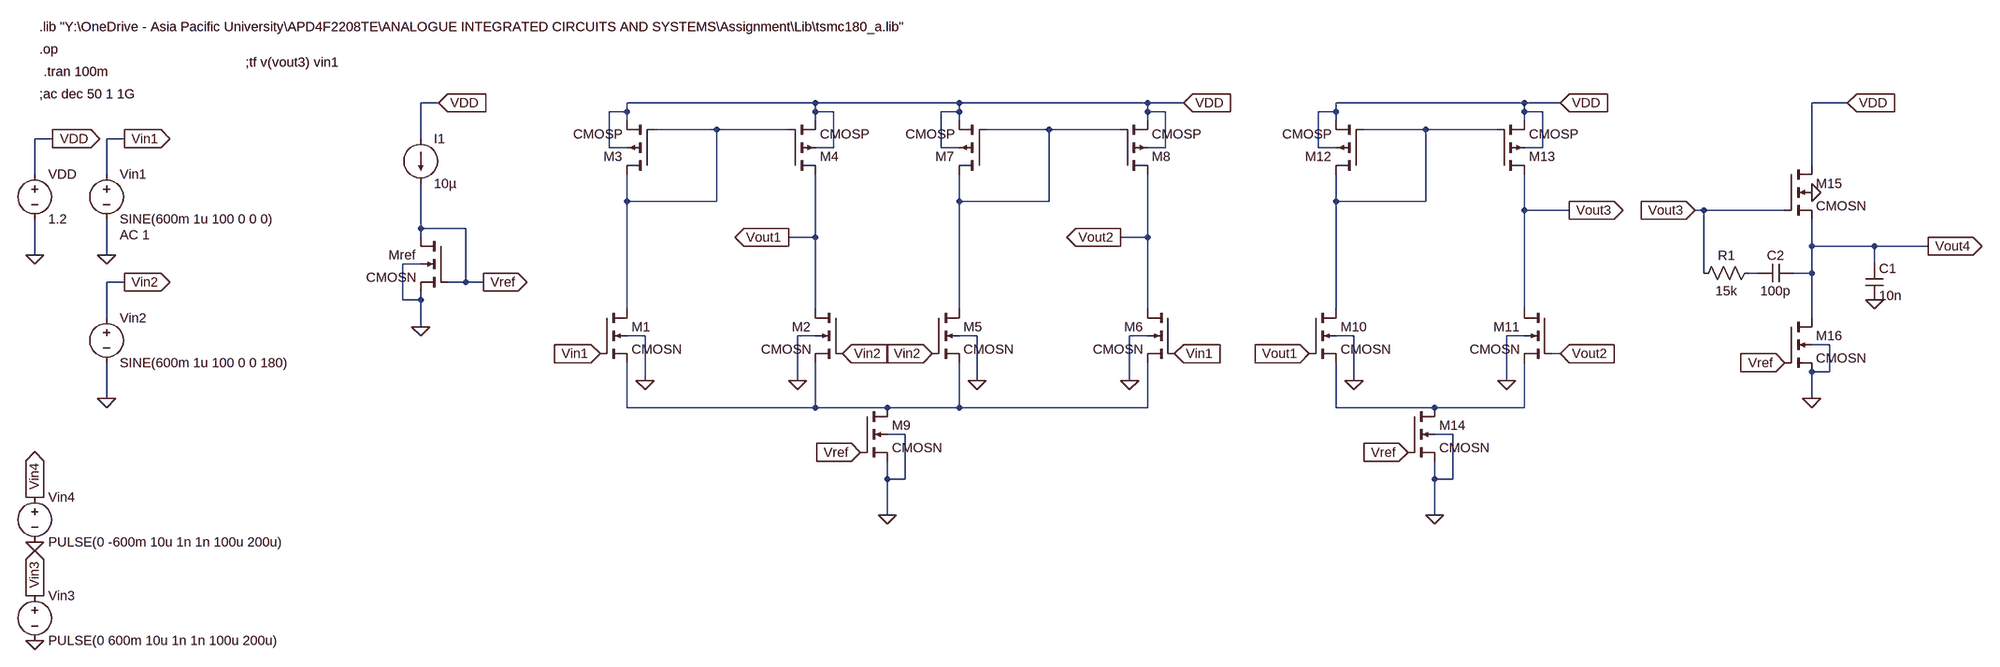
[diagram p0: schematic Final.asc]
Final.asc, the LTspice schematic file:
Version 4
SHEET 1 4092 1284
WIRE -176 -672 -208 -672
WIRE 496 -672 160 -672
WIRE 752 -672 496 -672
WIRE 1088 -672 752 -672
WIRE 1152 -672 1088 -672
WIRE 1760 -672 1424 -672
WIRE 1824 -672 1760 -672
WIRE 2336 -672 2272 -672
WIRE 160 -656 160 -672
WIRE 160 -656 128 -656
WIRE 496 -656 496 -672
WIRE 528 -656 496 -656
WIRE 752 -656 752 -672
WIRE 752 -656 720 -656
WIRE 1088 -656 1088 -672
WIRE 1120 -656 1088 -656
WIRE 1424 -656 1424 -672
WIRE 1424 -656 1392 -656
WIRE 1760 -656 1760 -672
WIRE 1792 -656 1760 -656
WIRE 160 -640 160 -656
WIRE 496 -640 496 -656
WIRE 752 -640 752 -656
WIRE 1088 -640 1088 -656
WIRE 1424 -640 1424 -656
WIRE 1760 -640 1760 -656
WIRE 320 -624 208 -624
WIRE 448 -624 320 -624
WIRE 912 -624 800 -624
WIRE 1040 -624 912 -624
WIRE 1584 -624 1472 -624
WIRE 1712 -624 1584 -624
WIRE -864 -608 -896 -608
WIRE -736 -608 -768 -608
WIRE -208 -608 -208 -672
WIRE 128 -592 128 -656
WIRE 160 -592 128 -592
WIRE 528 -592 528 -656
WIRE 528 -592 496 -592
WIRE 720 -592 720 -656
WIRE 752 -592 720 -592
WIRE 1120 -592 1120 -656
WIRE 1120 -592 1088 -592
WIRE 1392 -592 1392 -656
WIRE 1424 -592 1392 -592
WIRE 1792 -592 1792 -656
WIRE 1792 -592 1760 -592
WIRE 2272 -560 2272 -672
WIRE -896 -544 -896 -608
WIRE -768 -544 -768 -608
WIRE 160 -496 160 -544
WIRE 320 -496 320 -624
WIRE 320 -496 160 -496
WIRE 752 -496 752 -544
WIRE 912 -496 912 -624
WIRE 912 -496 752 -496
WIRE 1424 -496 1424 -544
WIRE 1584 -496 1584 -624
WIRE 1584 -496 1424 -496
WIRE 1760 -480 1760 -544
WIRE 1840 -480 1760 -480
WIRE 2080 -480 2064 -480
WIRE 2224 -480 2080 -480
WIRE -208 -448 -208 -528
WIRE -128 -448 -208 -448
WIRE -208 -432 -208 -448
WIRE 496 -432 496 -544
WIRE 496 -432 448 -432
WIRE 1088 -432 1088 -544
WIRE 1088 -432 1040 -432
WIRE 2272 -416 2272 -464
WIRE 2384 -416 2272 -416
WIRE 2480 -416 2384 -416
WIRE -896 -400 -896 -464
WIRE -768 -400 -768 -464
WIRE -208 -384 -240 -384
WIRE 2384 -384 2384 -416
WIRE 2080 -368 2080 -480
WIRE 2176 -368 2160 -368
WIRE 2272 -368 2272 -416
WIRE 2272 -368 2240 -368
WIRE -736 -352 -768 -352
WIRE -128 -352 -128 -448
WIRE -128 -352 -160 -352
WIRE -96 -352 -128 -352
WIRE -240 -320 -240 -384
WIRE -208 -320 -208 -336
WIRE -208 -320 -240 -320
WIRE 160 -304 160 -496
WIRE 496 -304 496 -432
WIRE 752 -304 752 -496
WIRE 1088 -304 1088 -432
WIRE 1424 -304 1424 -496
WIRE 1760 -304 1760 -480
WIRE -768 -288 -768 -352
WIRE 2272 -288 2272 -368
WIRE -208 -272 -208 -320
WIRE 192 -256 160 -256
WIRE 496 -256 464 -256
WIRE 784 -256 752 -256
WIRE 1088 -256 1056 -256
WIRE 1456 -256 1424 -256
WIRE 1760 -256 1728 -256
WIRE 2304 -240 2272 -240
WIRE 1824 -224 1808 -224
WIRE 2304 -192 2304 -240
WIRE 2304 -192 2272 -192
WIRE 192 -176 192 -256
WIRE 464 -176 464 -256
WIRE 784 -176 784 -256
WIRE 1056 -176 1056 -256
WIRE 1456 -176 1456 -256
WIRE 1728 -176 1728 -256
WIRE -768 -144 -768 -208
WIRE 2272 -144 2272 -192
WIRE 160 -128 160 -208
WIRE 496 -128 496 -208
WIRE 496 -128 160 -128
WIRE 624 -128 496 -128
WIRE 752 -128 752 -208
WIRE 752 -128 624 -128
WIRE 1088 -128 1088 -208
WIRE 1088 -128 752 -128
WIRE 1424 -128 1424 -208
WIRE 1600 -128 1424 -128
WIRE 1760 -128 1760 -208
WIRE 1760 -128 1600 -128
WIRE 656 -80 624 -80
WIRE 1632 -80 1600 -80
WIRE 624 0 624 -32
WIRE 656 0 656 -80
WIRE 656 0 624 0
WIRE 1600 0 1600 -32
WIRE 1632 0 1632 -80
WIRE 1632 0 1600 0
WIRE 624 64 624 0
WIRE 1600 64 1600 0
FLAG 112 -224 Vin1
IOPIN 112 -224 In
FLAG -96 -352 Vref
IOPIN -96 -352 Out
FLAG -208 -272 0
FLAG 192 -176 0
FLAG 464 -176 0
FLAG 2336 -672 VDD
IOPIN 2336 -672 In
FLAG 448 -432 Vout1
IOPIN 448 -432 Out
FLAG 1136 -224 Vin1
IOPIN 1136 -224 In
FLAG 784 -176 0
FLAG 1056 -176 0
FLAG 624 64 0
FLAG 576 -48 Vref
IOPIN 576 -48 In
FLAG 1040 -432 Vout2
IOPIN 1040 -432 Out
FLAG 1376 -224 Vout1
IOPIN 1376 -224 In
FLAG 1824 -224 Vout2
IOPIN 1824 -224 In
FLAG 1456 -176 0
FLAG 1728 -176 0
FLAG 1600 64 0
FLAG 1552 -48 Vref
IOPIN 1552 -48 In
FLAG 2272 -144 0
FLAG 2384 -320 0
FLAG 2480 -416 Vout4
IOPIN 2480 -416 Out
FLAG 2224 -208 Vref
IOPIN 2224 -208 In
FLAG 2272 -512 0
FLAG -896 -400 0
FLAG -864 -608 VDD
IOPIN -864 -608 Out
FLAG -736 -608 Vin1
IOPIN -736 -608 Out
FLAG -768 -400 0
FLAG -768 -144 0
FLAG -736 -352 Vin2
IOPIN -736 -352 Out
FLAG -896 288 0
FLAG -896 112 0
FLAG -896 208 Vin3
IOPIN -896 208 Out
FLAG -896 32 Vin4
IOPIN -896 32 Out
FLAG 1840 -480 Vout3
IOPIN 1840 -480 Out
FLAG 2064 -480 Vout3
IOPIN 2064 -480 In
FLAG 1152 -672 VDD
IOPIN 1152 -672 In
FLAG -176 -672 VDD
IOPIN -176 -672 In
FLAG 1824 -672 VDD
IOPIN 1824 -672 In
FLAG 544 -224 Vin2
IOPIN 544 -224 In
FLAG 704 -224 Vin2
IOPIN 704 -224 In
DATAFLAG 160 -416 ""
DATAFLAG 496 -432 ""
DATAFLAG 304 -624 ""
DATAFLAG 752 -416 ""
DATAFLAG 1088 -432 ""
DATAFLAG 624 -128 ""
DATAFLAG 896 -624 ""
DATAFLAG 1424 -416 ""
DATAFLAG 1760 -432 ""
DATAFLAG 1568 -128 ""
DATAFLAG 1568 -624 ""
DATAFLAG 2384 -416 ""
SYMBOL nmos4 112 -304 R0
SYMATTR InstName M1
SYMATTR Value CMOSN
SYMATTR Value2 l=0.36u w=3.4u
SYMBOL nmos4 544 -304 M0
SYMATTR InstName M2
SYMATTR Value CMOSN
SYMATTR Value2 l=0.36u w=3.4u
SYMBOL current -208 -608 R0
WINDOW 123 0 0 Left 0
WINDOW 39 0 0 Left 0
SYMATTR InstName I1
SYMATTR Value 10µ
SYMBOL nmos4 -160 -432 M0
SYMATTR InstName Mref
SYMATTR Value CMOSN
SYMATTR Value2 l=0.18u w=10u
SYMBOL pmos4 208 -544 R180
SYMATTR InstName M3
SYMATTR Value CMOSP
SYMATTR Value2 l=0.36u w=3.4u
SYMBOL pmos4 448 -544 M180
SYMATTR InstName M4
SYMATTR Value CMOSP
SYMATTR Value2 l=0.36u w=3.4u
SYMBOL nmos4 704 -304 R0
SYMATTR InstName M5
SYMATTR Value CMOSN
SYMATTR Value2 l=0.36u w=3.4u
SYMBOL nmos4 1136 -304 M0
SYMATTR InstName M6
SYMATTR Value CMOSN
SYMATTR Value2 l=0.36u w=3.4u
SYMBOL pmos4 800 -544 R180
SYMATTR InstName M7
SYMATTR Value CMOSP
SYMATTR Value2 l=0.36u w=3.4u
SYMBOL pmos4 1040 -544 M180
SYMATTR InstName M8
SYMATTR Value CMOSP
SYMATTR Value2 l=0.36u w=3.4u
SYMBOL nmos4 576 -128 R0
SYMATTR InstName M9
SYMATTR Value CMOSN
SYMATTR Value2 l=0.18u w=40u
SYMBOL nmos4 1376 -304 R0
SYMATTR InstName M10
SYMATTR Value CMOSN
SYMATTR Value2 l=0.72u w=6.8u
SYMBOL nmos4 1808 -304 M0
SYMATTR InstName M11
SYMATTR Value CMOSN
SYMATTR Value2 l=0.72u w=6.8u
SYMBOL pmos4 1472 -544 R180
SYMATTR InstName M12
SYMATTR Value CMOSP
SYMATTR Value2 l=0.72u w=6.8u
SYMBOL pmos4 1712 -544 M180
SYMATTR InstName M13
SYMATTR Value CMOSP
SYMATTR Value2 l=0.72u w=6.8u
SYMBOL nmos4 1552 -128 R0
SYMATTR InstName M14
SYMATTR Value CMOSN
SYMATTR Value2 l=0.18u w=20u
SYMBOL nmos4 2224 -288 R0
SYMATTR InstName M16
SYMATTR Value CMOSN
SYMATTR Value2 l=0.18u w=10u
SYMBOL cap 2368 -384 R0
SYMATTR InstName C1
SYMATTR Value 10n
SYMBOL nmos4 2224 -560 R0
SYMATTR InstName M15
SYMATTR Value CMOSN
SYMATTR Value2 l=0.18u w=100u
SYMBOL cap 2240 -384 R90
WINDOW 0 0 32 VBottom 2
WINDOW 3 32 32 VTop 2
SYMATTR InstName C2
SYMATTR Value 100p
SYMBOL res 2176 -384 R90
WINDOW 0 0 56 VBottom 2
WINDOW 3 32 56 VTop 2
SYMATTR InstName R1
SYMATTR Value 15k
SYMBOL voltage -896 -560 R0
WINDOW 123 0 0 Left 0
WINDOW 39 0 0 Left 0
SYMATTR InstName VDD
SYMATTR Value 1.2
SYMBOL voltage -768 -560 R0
WINDOW 123 24 124 Left 2
WINDOW 39 0 0 Left 0
SYMATTR Value2 AC 1
SYMATTR InstName Vin1
SYMATTR Value SINE(600m 1u 100 0 0 0)
SYMBOL voltage -768 -304 R0
WINDOW 123 24 44 Left 2
WINDOW 39 0 0 Left 0
SYMATTR InstName Vin2
SYMATTR Value SINE(600m 1u 100 0 0 180)
SYMBOL voltage -896 192 R0
WINDOW 123 24 124 Left 2
WINDOW 39 0 0 Left 0
SYMATTR InstName Vin3
SYMATTR Value PULSE(0 600m 10u 1n 1n 100u 200u)
SYMBOL voltage -896 16 R0
WINDOW 123 24 44 Left 2
WINDOW 39 0 0 Left 0
SYMATTR InstName Vin4
SYMATTR Value PULSE(0 -600m 10u 1n 1n 100u 200u)
TEXT -888 -808 Left 2 !.lib "Y:\\OneDrive - Asia Pacific University\\APD4F2208TE\\ANALOGUE INTEGRATED CIRCUITS AND SYSTEMS\\Assignment\\Lib\\tsmc180_a.lib"
TEXT -888 -768 Left 2 !.op
TEXT -888 -688 Left 2 !;ac dec 50 1 1G
TEXT -880 -728 Left 2 !.tran 100m
TEXT -520 -744 Left 2 !;tf v(vout3) vin1

The netlist it stands for:
* Final.asc
M1 N001 Vin1 N005 0 CMOSN l=0.36u w=3.4u
M2 Vout1 Vin2 N005 0 CMOSN l=0.36u w=3.4u
I1 VDD Vref 10µ
Mref Vref Vref 0 0 CMOSN l=0.18u w=10u
M3 N001 N001 VDD VDD CMOSP l=0.36u w=3.4u
M4 Vout1 N001 VDD VDD CMOSP l=0.36u w=3.4u
M5 N002 Vin2 N005 0 CMOSN l=0.36u w=3.4u
M6 Vout2 Vin1 N005 0 CMOSN l=0.36u w=3.4u
M7 N002 N002 VDD VDD CMOSP l=0.36u w=3.4u
M8 Vout2 N002 VDD VDD CMOSP l=0.36u w=3.4u
M9 N005 Vref 0 0 CMOSN l=0.18u w=40u
M10 N003 Vout1 N006 0 CMOSN l=0.72u w=6.8u
M11 Vout3 Vout2 N006 0 CMOSN l=0.72u w=6.8u
M12 N003 N003 VDD VDD CMOSP l=0.72u w=6.8u
M13 Vout3 N003 VDD VDD CMOSP l=0.72u w=6.8u
M14 N006 Vref 0 0 CMOSN l=0.18u w=20u
M16 Vout4 Vref 0 0 CMOSN l=0.18u w=10u
C1 Vout4 0 10n
M15 VDD Vout3 Vout4 0 CMOSN l=0.18u w=100u
C2 Vout4 N004 100p
R1 N004 Vout3 15k
VDD VDD 0 1.2
Vin1 Vin1 0 SINE(600m 1u 100 0 0 0) AC 1
Vin2 Vin2 0 SINE(600m 1u 100 0 0 180)
Vin3 Vin3 0 PULSE(0 600m 10u 1n 1n 100u 200u)
Vin4 Vin4 0 PULSE(0 -600m 10u 1n 1n 100u 200u)
.model NMOS NMOS
.model PMOS PMOS
.lib standard.mos
.lib "Y:\OneDrive - Asia Pacific University\APD4F2208TE\ANALOGUE INTEGRATED CIRCUITS AND SYSTEMS\Assignment\Lib\tsmc180_a.lib"
.op
;ac dec 50 1 1G
.tran 100m
;tf v(vout3) vin1
.backanno
.end